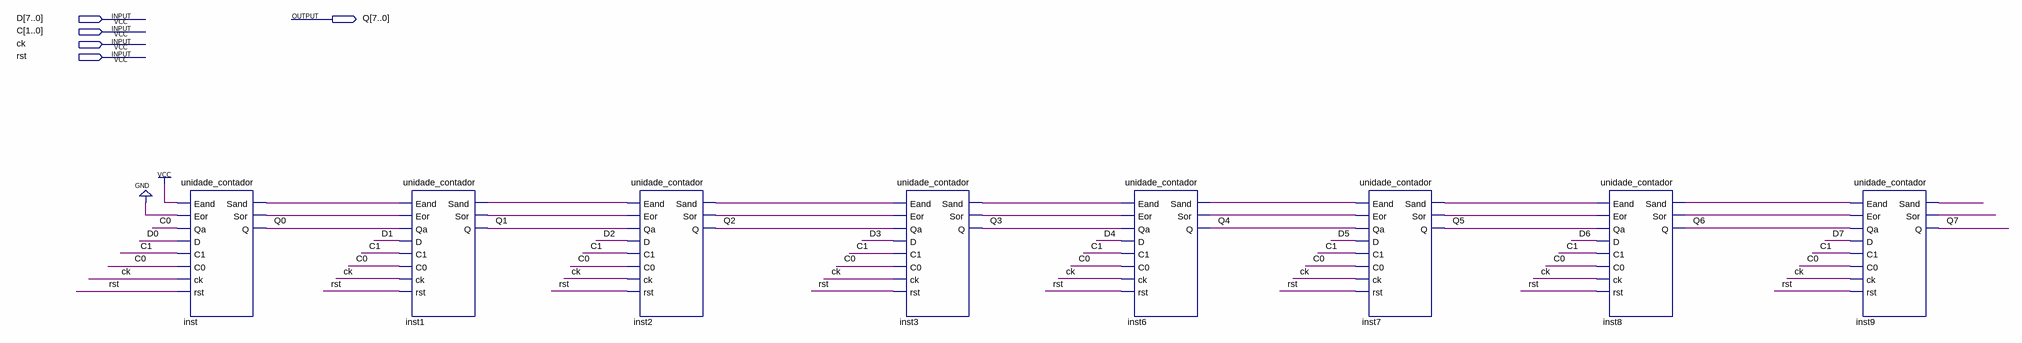
[diagram p0: schematic sheet]
// Quartus schematic contador_8bits.bdf as structural Verilog: 8 symbols, 5 pins
module contador_8bits (
  input  [7:0] D,
  input  [1:0] C,
  input  ck,
  input  rst,
  output [7:0] Q
);

  wire inst1_sand, inst1_sor, inst2_sand, inst2_sor, inst3_sand, inst3_sor, inst6_sand, inst6_sor,
       inst7_sand, inst7_sor, inst8_sand, inst8_sor, inst9_sand, inst9_sor, inst_sand, inst_sor;

  unidade_contador inst (
    .Eand(1'b1), .Eor(1'b0), .Qa(C[0]), .D(D[0]), .C1(C[1]), .C0(C[0]), .ck(ck), .rst(rst), .Sand(inst_sand),
    .Sor(inst_sor), .Q(Q[0]));
  unidade_contador inst1 (
    .Eand(inst_sand), .Eor(inst_sor), .Qa(Q[0]), .D(D[1]), .C1(C[1]), .C0(C[0]), .ck(ck), .rst(rst),
    .Sand(inst1_sand), .Sor(inst1_sor), .Q(Q[1]));
  unidade_contador inst2 (
    .Eand(inst1_sand), .Eor(inst1_sor), .Qa(Q[1]), .D(D[2]), .C1(C[1]), .C0(C[0]), .ck(ck), .rst(rst),
    .Sand(inst2_sand), .Sor(inst2_sor), .Q(Q[2]));
  unidade_contador inst3 (
    .Eand(inst2_sand), .Eor(inst2_sor), .Qa(Q[2]), .D(D[3]), .C1(C[1]), .C0(C[0]), .ck(ck), .rst(rst),
    .Sand(inst3_sand), .Sor(inst3_sor), .Q(Q[3]));
  unidade_contador inst6 (
    .Eand(inst3_sand), .Eor(inst3_sor), .Qa(Q[3]), .D(D[4]), .C1(C[1]), .C0(C[0]), .ck(ck), .rst(rst),
    .Sand(inst6_sand), .Sor(inst6_sor), .Q(Q[4]));
  unidade_contador inst7 (
    .Eand(inst6_sand), .Eor(inst6_sor), .Qa(Q[4]), .D(D[5]), .C1(C[1]), .C0(C[0]), .ck(ck), .rst(rst),
    .Sand(inst7_sand), .Sor(inst7_sor), .Q(Q[5]));
  unidade_contador inst8 (
    .Eand(inst7_sand), .Eor(inst7_sor), .Qa(Q[5]), .D(D[6]), .C1(C[1]), .C0(C[0]), .ck(ck), .rst(rst),
    .Sand(inst8_sand), .Sor(inst8_sor), .Q(Q[6]));
  unidade_contador inst9 (
    .Eand(inst8_sand), .Eor(inst8_sor), .Qa(Q[6]), .D(D[7]), .C1(C[1]), .C0(C[0]), .ck(ck), .rst(rst),
    .Sand(inst9_sand), .Sor(inst9_sor), .Q(Q[7]));
endmodule
